# Altium schematic sheet Power ORing.SchDoc
size A4
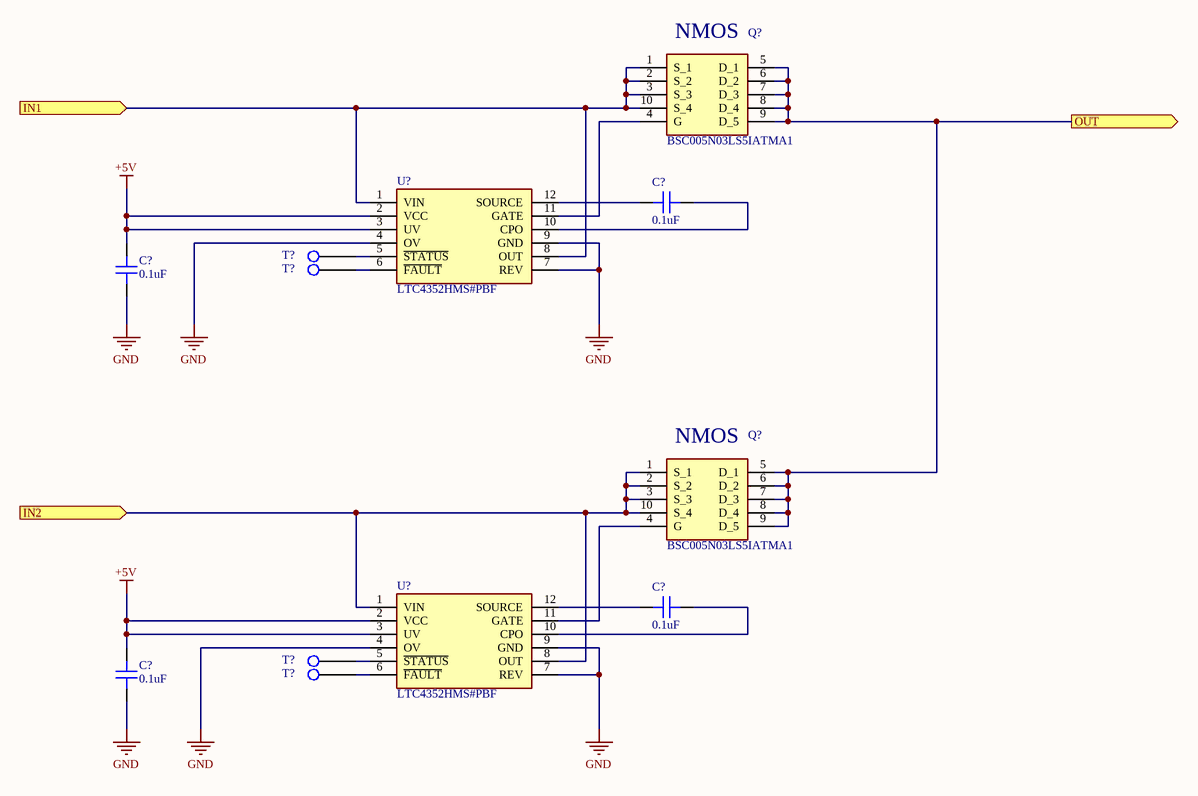
[diagram p0: Power ORing.SchDoc]

## Parts
(Parts that share a designator on the sheet are numbered #1, #2 ... from top to bottom, then left to right.)
C?#1  0.1uF  [CAP 0603_1608]
C?#2  0.1uF  [CAP 0603_1608]
C?#3  0.1uF  [CAP 0603_1608]
C?#4  0.1uF  [CAP 0603_1608]
Q?#1  BSC005N03LS5IATMA1  [TDSON_8_FL]
Q?#2  BSC005N03LS5IATMA1  [TDSON_8_FL]
T?#1  TP  [TP]  (value not drawn)
T?#2  TP  [TP]  (value not drawn)
T?#3  TP  [TP]  (value not drawn)
T?#4  TP  [TP]  (value not drawn)
U?#1  LTC4352HMS#PBF  [MSOP-12]
U?#2  LTC4352HMS#PBF  [MSOP-12]

## Ports
IN1 (in), IN2 (in), OUT (out)

## Nets
+5V: C?#2.2 C?#4.2 U?#1.2(VCC) U?#1.3(UV) U?#2.2(VCC) U?#2.3(UV)
GND: C?#2.1 C?#4.1 U?#1.4(OV) U?#1.7(REV) U?#1.9(GND) U?#2.4(OV) U?#2.7(REV) U?#2.9(GND)
IN1: Q?#1.1(S_1) Q?#1.2(S_2) Q?#1.3(S_3) Q?#1.10(S_4) U?#1.1(VIN) U?#1.8(OUT) ; port IN1
IN2: Q?#2.1(S_1) Q?#2.2(S_2) Q?#2.3(S_3) Q?#2.10(S_4) U?#2.1(VIN) U?#2.8(OUT) ; port IN2
OUT: Q?#1.5(D_1) Q?#1.6(D_2) Q?#1.7(D_3) Q?#1.8(D_4) Q?#1.9(D_5) Q?#2.5(D_1) Q?#2.6(D_2) Q?#2.7(D_3) Q?#2.8(D_4) Q?#2.9(D_5) ; port OUT
NetC?#1_1: C?#1.1 U?#1.10(CPO)
NetC?#1_2: C?#1.2 U?#1.12(SOURCE)
NetC?#3_1: C?#3.1 U?#2.10(CPO)
NetC?#3_2: C?#3.2 U?#2.12(SOURCE)
NetQ?#1_4: Q?#1.4(G) U?#1.11(GATE)
NetQ?#2_4: Q?#2.4(G) U?#2.11(GATE)
NetT?#1_1: T?#1.1 U?#1.5(~{STATUS})
NetT?#2_1: T?#2.1 U?#1.6(~{FAULT})
NetT?#3_1: T?#3.1 U?#2.5(~{STATUS})
NetT?#4_1: T?#4.1 U?#2.6(~{FAULT})

## Library data of the parts
C?#1-C?#4 = C0603C104K5RACTU: KEMET - C0603C104K5RACTU - SMD Multilayer Cer; Dielectric Material: Ceramic; Capacitance: 100nF; Tolerance: 10%; Voltage Rating (DC): 50V; Dielectric: X7R; Part Number: C0603C104K5RACTU; Value: 0.1uF; Part Name: C0603C104K5RACTU; Supplier 1: Mouser; Supplier Part Number 1: 80-C0603C104K5R; Manufacturer: KEMET; Manufacturer Part Number: C0603C104K5RACTU; RoHS: Yes; Category: Ceramic Capacitors; Stock 1: 3092110; Pricing 1: 1=0.26000, 10=0.11800, 50=0.11800, 100=0.0730; Mount: Surface Mount; Case/Package: 0603; Case Code (Metric): 1608; Case Code (Imperial): 0603; Min Operating Temperature: -55°C; Max Operating Temperature: 125°C; Packaging: Tape and Reel; Package Quantity: 4000; Termination: SMD/SMT; Voltage: 50V; Length: 1.6mm; Width: 0.8mm; RoHS Compliant: Yes; ComponentLink1URL: https://datasheet.ciiva.com/29242/457901-da-0; ComponentLink1Description: https://datasheet.ciiva.com/29242/457901-da-0; Supplier 2: Mouser; Supplier Part Number 2: 80-C0603C104K5RAC; Stock 2: 377106; Pricing 2: 1=0.26000, 10=0.11800, 50=0.11800, 100=0.0730; Material: Ceramic
Q?#1 Q?#2 = BSC005N03LS5IATMA1: NMOS; Manufacturer: Infineon; Part Number: BSC005N03LS5IATMA1; Value: NMOS; Part Name: BSC005N03LS5IATMA1; Supplier 1: Mouser; Supplier Part Number 1: 726-BSC005N03LS5IATM; Manufacturer Part Number: BSC005N03LS5IATMA1; RoHS: No; Stock 1: 1595; Pricing 1: 1=2.96000, 10=2.66000, 25=2.51000, 50=2.51000
T?#1-T?#4 = Test Point 1mm: EMBOSS ASSY DDR2 SODIMM SOCKET 200P 5.2H; Manufacturer: TE Connectivity AMP; Manufacturer Part Number: 1717254-4; Voltage Rating: 1.8V; Number of Positions: 200; Gender: Female; PCB Mount Retention: With; Contact Current Rating: 500mA; Circuit Application: Power; Connector System: Cable-to-Board; Sealable: No (Without); Pitch: 0.024inch; Row Spacing: 0.244inch; Stack Height: 5.2mm; Part Number: Test Point 1mm; Part Name: Test Point 1mm; Supplier 1: Mouser; Supplier Part Number 1: 571-1717254-4; RoHS: Yes; Category: Memory Connectors; Stock 1: 5354; Pricing 1: 1=4.59000, 10=3.76000, 50=3.76000, 100=3.6400; Mount: Surface Mount; Contact Material: Copper Alloy; Contact Plating: Gold; Housing Color: Black; Housing Material: Thermoplastic; Min Operating Temperature: -67°C; Max Operating Temperature: 185°C; Package Quantity: 150; Packaging: Tape and Reel; Termination: SMD/SMT; Number of Contacts: 200; Orientation: Right Angle; Number of Rows: 2; Height: 5.2mm; ELV: Compliant; Flammability Rating: UL94 V-0; RoHS Compliant: Yes; ComponentLink1URL: http://components.arrow.com/part/dataview/032; ComponentLink1Description: http://components.arrow.com/part/dataview/032; ComponentLink2URL: http://components.arrow.com/part/dataview/491; ComponentLink2Description: http://components.arrow.com/part/dataview/491; ComponentLink3URL: https://www.te.com/commerce/DocumentDelivery/; ComponentLink3Description: https://www.te.com/commerce/DocumentDelivery/; ComponentLink4URL: https://www.te.com/commerce/DocumentDelivery/; ComponentLink4Description: https://www.te.com/commerce/DocumentDelivery/; ComponentLink5URL: http://www.te.com/commerce/DocumentDelivery/D; ComponentLink5Description: http://www.te.com/commerce/DocumentDelivery/D; ComponentLink6URL: http://www.te.com/catalog/pn/en/1717254-4?RQP; ComponentLink6Description: http://www.te.com/catalog/pn/en/1717254-4?RQP
U?#1 U?#2 = LTC4352HMS#PBF: IC OR CTRLR N+1 12MSOP; Manufacturer: Analog Devices / Linear Technology; Value: 0-18V; Min Supply Voltage: 2.9V; Max Supply Voltage: 18V; Number of Outputs: 1; Turn-On Delay Time: 250ns; Turn-Off Delay Time: 500ns; Part Number: LTC4352HMS#PBF; Part Name: LTC4352HMS#PBF; Supplier 1: Digi-Key; Supplier Part Number 1: LTC4352HMS#PBF-ND; Manufacturer Part Number: LTC4352HMS#PBF; RoHS: Yes; Category: Integrated Circuits (ICs); Stock 1: 911; Pricing 1: 1=8.00000, 10=7.22400, 25=6.88840, 100=5.9812; Case/Package: MSOP; Number of Pins: 12; Min Operating Temperature: -40°C; Max Operating Temperature: 150°C; Package Quantity: 37; Number of Drivers: 1; Series: -; Radiation Hardening: No; REACH SVHC: No SVHC; Lead Free: Lead Free; RoHS Compliant: Yes; ComponentLink1URL: https://datasheet.ciiva.com/15110/getdatashee; ComponentLink1Description: https://datasheet.ciiva.com/15110/getdatashee; ComponentLink2URL: https://datasheet.ciiva.com/22620/1692585-226; ComponentLink2Description: https://datasheet.ciiva.com/22620/1692585-226; ComponentLink3URL: https://datasheet.ciiva.com/1960/26584-196097; ComponentLink3Description: https://datasheet.ciiva.com/1960/26584-196097